# Altium schematic sheet LedsAndButtons.SchDoc
size 127 x 127 mm
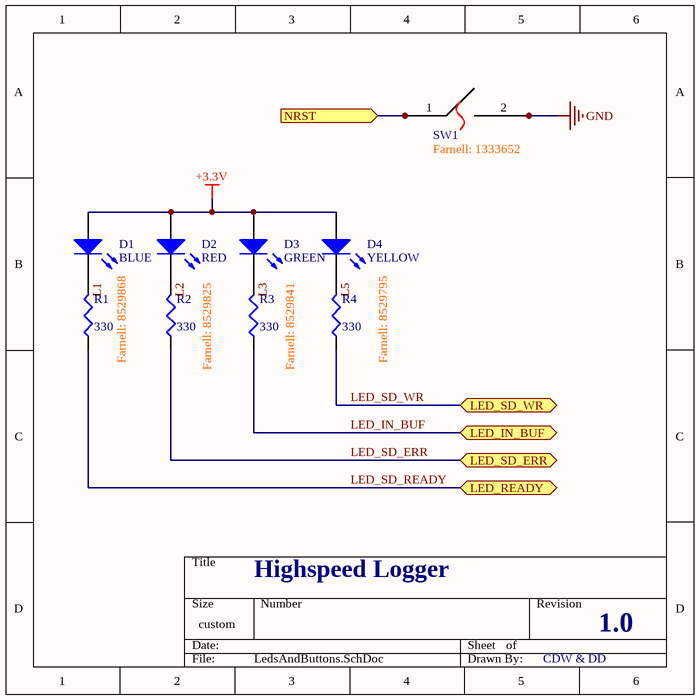
[diagram p0: LedsAndButtons.SchDoc]

## Parts
D1  BLUE  Farnell: 8529868  [KP-1608SURC_R]
D2  RED  Farnell: 8529825  [KP-1608SURC_B]
D3  GREEN  Farnell: 8529841  [KP-1608SURC_Y]
D4  YELLOW  Farnell: 8529795  [KP-1608SURC_G]
R1  value 330  [V0402RES]  (hidden comment: Res3)
R2  value 330  [V0402RES]  (hidden comment: Res3)
R3  value 330  [V0402RES]  (hidden comment: Res3)
R4  value 330  [V0402RES]  (hidden comment: Res3)
SW1  Farnell: 1333652  [TACTILE-B3U-1000P]  (hidden comment: Tactile OMRON B3U-1000P)

## Ports
LED_IN_BUF, LED_READY, LED_SD_ERR, LED_SD_WR, NRST (in)

## Nets
+3.3V: D1.1(A) D2.1(A) D3.1(A) D4.1(A)
GND: SW1.2
L1: D1.2(K) R1.2
L2: D2.2(K) R2.2
L3: D3.2(K) R3.2
L5: D4.2(K) R4.2
LED_IN_BUF: R3.1 ; port LED_IN_BUF
LED_SD_ERR: R2.1 ; port LED_SD_ERR
LED_SD_READY: R1.1 ; port LED_READY
LED_SD_WR: R4.1 ; port LED_SD_WR
NRST: SW1.1 ; port NRST

## Notes on the sheet
- Highspeed Logger
- 1.0
- CDW & DD

## Library data of the parts
D1-D4 = LED2: Typical RED, GREEN, YELLOW, AMBER GaAs LED; Published: 8-Jun-2000; LatestRevisionDate: 17-Jul-2002; LatestRevisionNote: Re-released for DXP Platform.; PackageVersion: Feb-2002; PackageReference: 3.2X1.6X1.1; Publisher: Altium Limited; PackageDescription: SM LED; 2 Flat Leads
R1-R4 = Res3: Resistor; Published: 8-Jun-2000; LatestRevisionDate: 29-May-2009; LatestRevisionNote: IPC-7351 Footprint Added.; PackageReference: J1-0603; Publisher: Altium Limited; PackageDescription: Chip Resistor